# EAGLE design daughter-double3 (EAGLE 6.6.0)
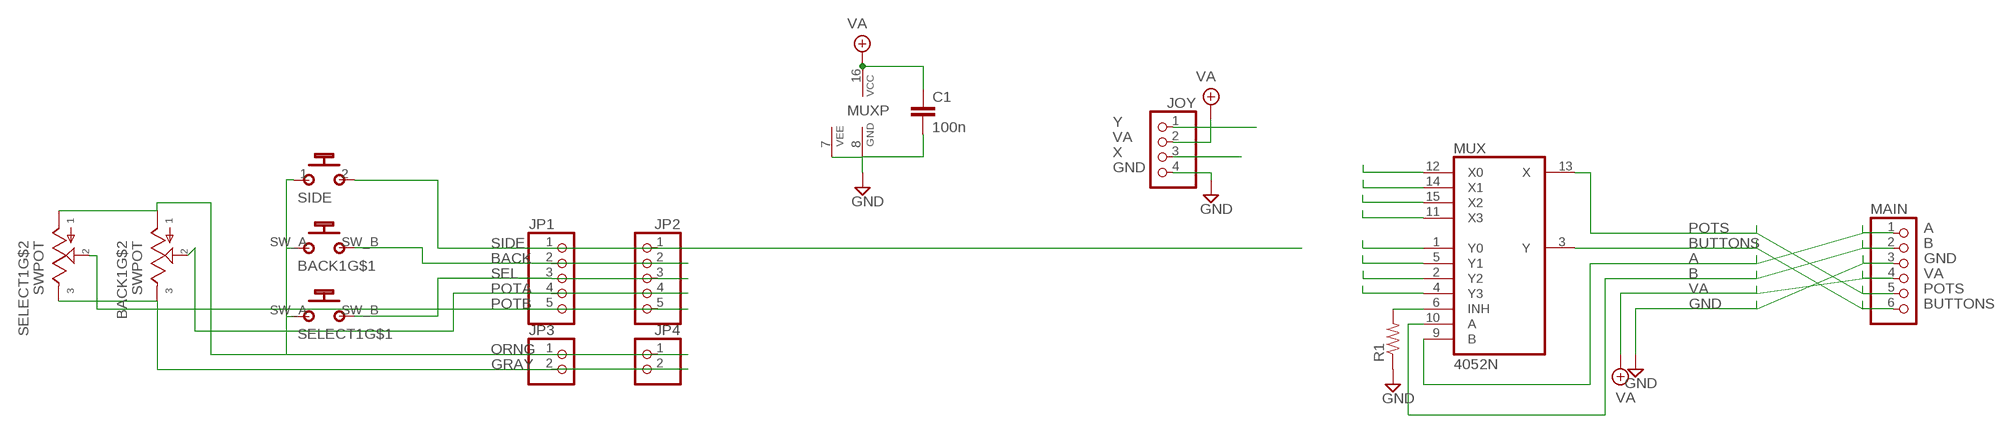
[diagram p0: schematic, sheet 1]

## Parts
BACK1  SWPOT  [SWPOT]
C1  100n  050X030_050  [050X030_050_3]
JOY  PINHD-1X4  [1X04]
JP1  PINHD-1X5  [1X05]
JP2  PINHD-1X5  [1X05]
JP3  PINHD-1X2  [1X02]
JP4  PINHD-1X2  [1X02]
MAIN  PINHD-1X6  [1X06]
MUX  4052N  [DIL16]
R1  6MM.1  [R0207/1V]
SELECT1  SWPOT  [SWPOT]
SIDE  MOMENTARYSPST1  [SPST]

## Nets
A: MAIN.1 MUX.9(B)
B: MAIN.2 MUX.10(A)
BACK: BACK1.SW_B(B_B) JP1.2 JP2.2
BUTTONS: MAIN.6 MUX.3(Y)
GND: C1.2 JOY.4 MAIN.3 MUX.7(VEE) MUX.8(GND) R1.1
GRAY: BACK1.POT_A JP3.2 JP4.2 SELECT1.POT_A
N$1: MUX.12(X0)
N$2: MUX.14(X1)
N$3: MUX.15(X2)
N$4: MUX.11(X3)
N$5: MUX.1(Y0)
N$6: MUX.6(INH) R1.2
N$7: MUX.5(Y1)
N$8: MUX.2(Y2)
N$9: MUX.4(Y3)
ORNG: BACK1.POT_B BACK1.SW_A(B_A) JP3.1 JP4.1 SELECT1.POT_B SELECT1.SW_A(B_A) SIDE.1(P)
POTA: BACK1.POT_W JP1.4 JP2.4
POTB: JP1.5 JP2.5 SELECT1.POT_W
POTS: MAIN.5 MUX.13(X)
SEL: JP1.3 JP2.3 SELECT1.SW_B(B_B)
SIDE: JP2.1 SIDE.2(S)
VA: C1.1 JOY.2 MAIN.4 MUX.16(VCC)
X: JOY.1
Y: JOY.3
Unconnected: JP1.1

## Library data of the parts
BACK1 SELECT1 = jaapie:SWPOT
C1 = gm-caps-ceramic:050X030_050: 120 - 150pF Xicon Ceramic Disc 5mm lead spacing
JOY = pinhead:PINHD-1X4: PIN HEADER
JP1 JP2 = pinhead:PINHD-1X5: PIN HEADER
JP3 JP4 = pinhead:PINHD-1X2: PIN HEADER
MAIN = pinhead:PINHD-1X6: PIN HEADER
MUX = 40xx:4052: Dual 4-channel ANALOG MULTIPLEXER
R1 = gm-resistors:6MM: 6mm Resistors Leads spaced 1-6 holes apart for 0.1" perfboard. Suitable for 1/4 watt resistors.
SIDE = gm-switches:MOMENTARY

## Board
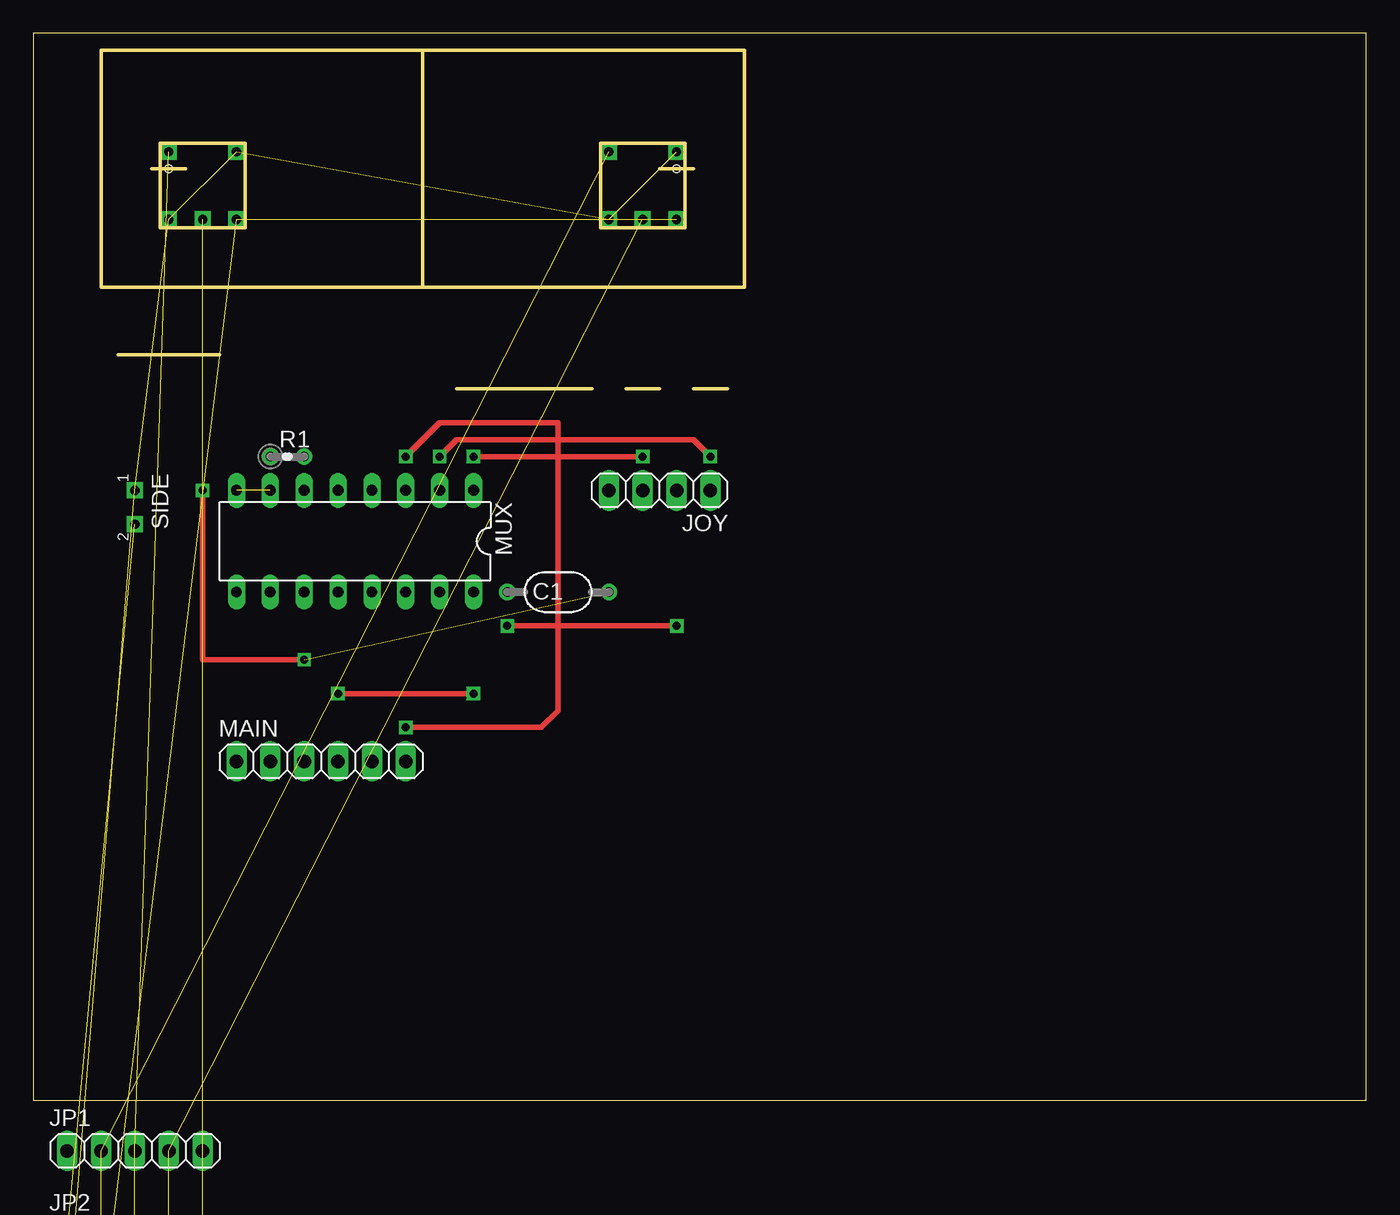
[diagram p1: board, top side]
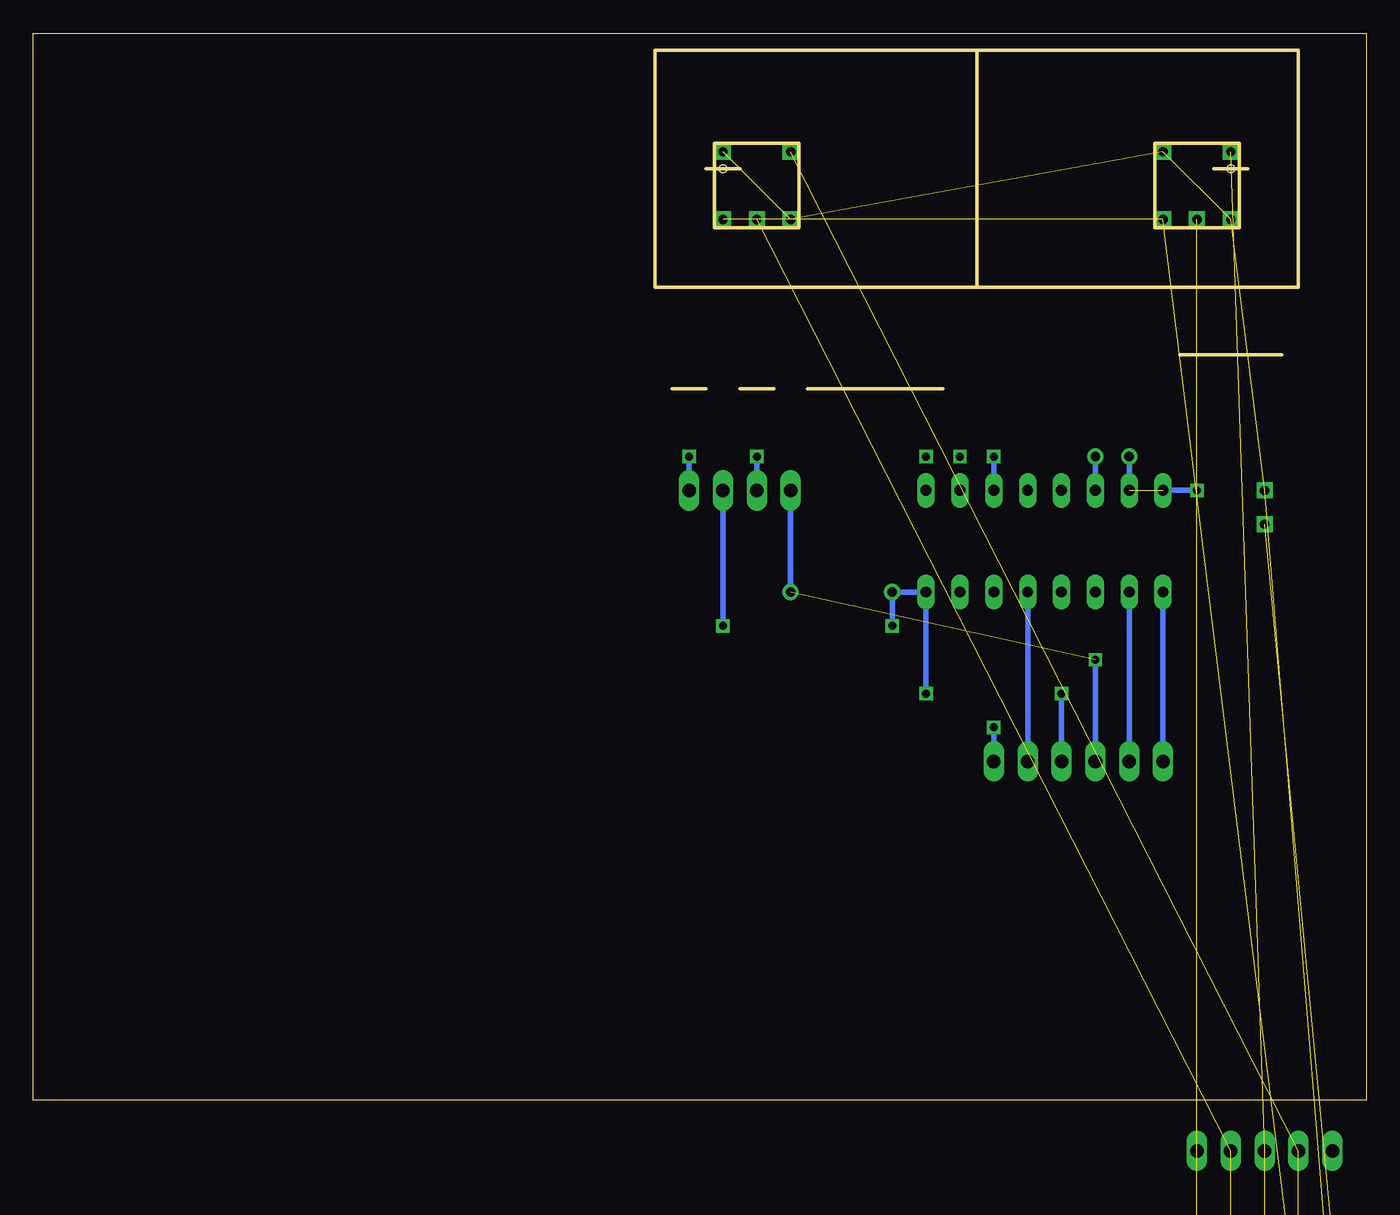
[diagram p2: board, bottom side, seen from below]

Size 100 x 80 mm. Coordinates in mm from the lower left corner, seen from the top.
Outline: 29.21,60.96 5.08,60.96 5.08,78.74 29.21,78.74
Outline: 29.21,60.96 53.34,60.96 53.34,78.74 29.21,78.74
Outline: 29.21,78.74 29.21,60.96
Outline: 8.89,69.85 11.43,69.85
Outline: 46.99,69.85 49.53,69.85
Outline: 6.35,55.88 13.97,55.88
Outline: 31.75,53.34 41.91,53.34
Outline: 44.45,53.34 46.99,53.34
Outline: 49.53,53.34 52.07,53.34
Outline: 0,0 100,0 100,80 0,80 0,0
Outline: 9.53,71.75 9.53,65.41 15.88,65.41 15.88,71.75 9.53,71.75
Outline: 42.55,71.75 48.9,71.75 48.9,65.41 42.55,65.41 42.55,71.75
Copper layers (1*16): Top 0.035mm / dielectric 1.5mm / Bottom 0.035mm
Design rules "default": minimum track width 10mil, minimum drill 24mil, track to track 8mil, track to pad 8mil, pad to pad 8mil, via to via 8mil, smd to smd 8mil, copper to edge 40mil, drill to drill 8mil, minimum pad ring 10mil, minimum via ring 8mil, stop-mask expansion 4mil, vias tented up to drill 0mil, thermal gap 10mil
Holes 0.6 mm at 10.16,69.85 48.26,69.85

### Footprints (pad centres in the part's own frame; a part is rotated, then mirrored left to right if it is on the bottom)
SWPOT = drill 0.7 square: POT_A -2.54,0; POT_B 2.54,0; POT_W 0,0; SW_A -2.54,-5.08; SW_B 2.54,-5.08
050X030_050_3 = drill 0.7: 1 -3.81,0; 2 3.81,0
1X04 = drill 1.016 long: 1 -3.81,0; 2 -1.27,0; 3 1.27,0; 4 3.81,0
1X05 = drill 1.016 long: 1 -5.08,0; 2 -2.54,0; 3 0,0; 4 2.54,0; 5 5.08,0
1X02 = drill 1.016 long: 1 -1.27,0; 2 1.27,0
1X06 = drill 1.016 long: 1 -6.35,0; 2 -3.81,0; 3 -1.27,0; 4 1.27,0; 5 3.81,0; 6 6.35,0
DIL16 = drill 0.813 long: 1 -8.89,-3.81; 2 -6.35,-3.81; 3 -3.81,-3.81; 4 -1.27,-3.81; 5 1.27,-3.81; 6 3.81,-3.81; 7 6.35,-3.81; 8 8.89,-3.81; 9 8.89,3.81; 10 6.35,3.81; 11 3.81,3.81; 12 1.27,3.81; 13 -1.27,3.81; 14 -3.81,3.81; 15 -6.35,3.81; 16 -8.89,3.81
R0207/1V = drill 0.7: 1 -1.27,0; 2 1.27,0
SPST = drill 0.7 square: 1 -1.27,0; 2 1.27,0

### Placement (x,y rotation side)
BACK1  45.72,66.04 180 top
C1  39.37,38.1 0 top
JOY  46.99,45.72 180 top
JP1  7.62,-3.81 0 top  (outside the outline)
JP2  7.62,-10.16 0 top  (outside the outline)
JP3  3.81,-16.51 0 top  (outside the outline)
JP4  3.81,-22.86 0 top  (outside the outline)
MAIN  21.59,25.4 0 top
MUX  24.13,41.91 180 top
R1  19.05,48.26 0 top
SELECT1  12.7,66.04 180 top
SIDE  7.62,44.45 270 top

### Tracks (layer width: path | path; a pad name or v marks a point on that pad's centre or on a via)
A
  Bottom 0.406: MUX.9 MAIN.1
B
  Bottom 0.406: MUX.10 MAIN.2
BACK  (2 unrouted)
BUTTONS  (via drill 0.6)
  Top 0.406: v27.94,27.94 38.1,27.94 39.37,29.21 39.37,50.8 30.48,50.8 v27.94,48.26
  Bottom 0.406: MUX.3 v27.94,48.26 | v27.94,27.94 MAIN.6
GND  (via drill 0.6)  (2 unrouted)
  Top 0.406: v20.32,33.02 12.7,33.02 v12.7,45.72
  Bottom 0.406: JOY.4 C1.2 | v12.7,45.72 MUX.8 | R1.1 MUX.7 | MAIN.3 v20.32,33.02
GRAY  (3 unrouted)
N$6
  Bottom 0.406: R1.2 MUX.6
ORNG  (6 unrouted)
POTA  (2 unrouted)
POTB  (2 unrouted)
POTS
  Bottom 0.406: MUX.13 MAIN.5
SEL  (2 unrouted)
SIDE  (1 unrouted)
VA  (via drill 0.6)
  Top 0.406: v48.26,35.56 v35.56,35.56 | v22.86,30.48 v33.02,30.48
  Bottom 0.406: JOY.2 v48.26,35.56 | v35.56,35.56 C1.1 MUX.16 v33.02,30.48 | MAIN.4 v22.86,30.48
X  (via drill 0.6)
  Top 0.406: v30.48,48.26 31.75,49.53 49.53,49.53 v50.8,48.26
  Bottom 0.406: JOY.1 v50.8,48.26
Y  (via drill 0.6)
  Top 0.406: v45.72,48.26 v33.02,48.26
  Bottom 0.406: JOY.3 v45.72,48.26